# EAGLE schematic back (EAGLE 6.5.0)
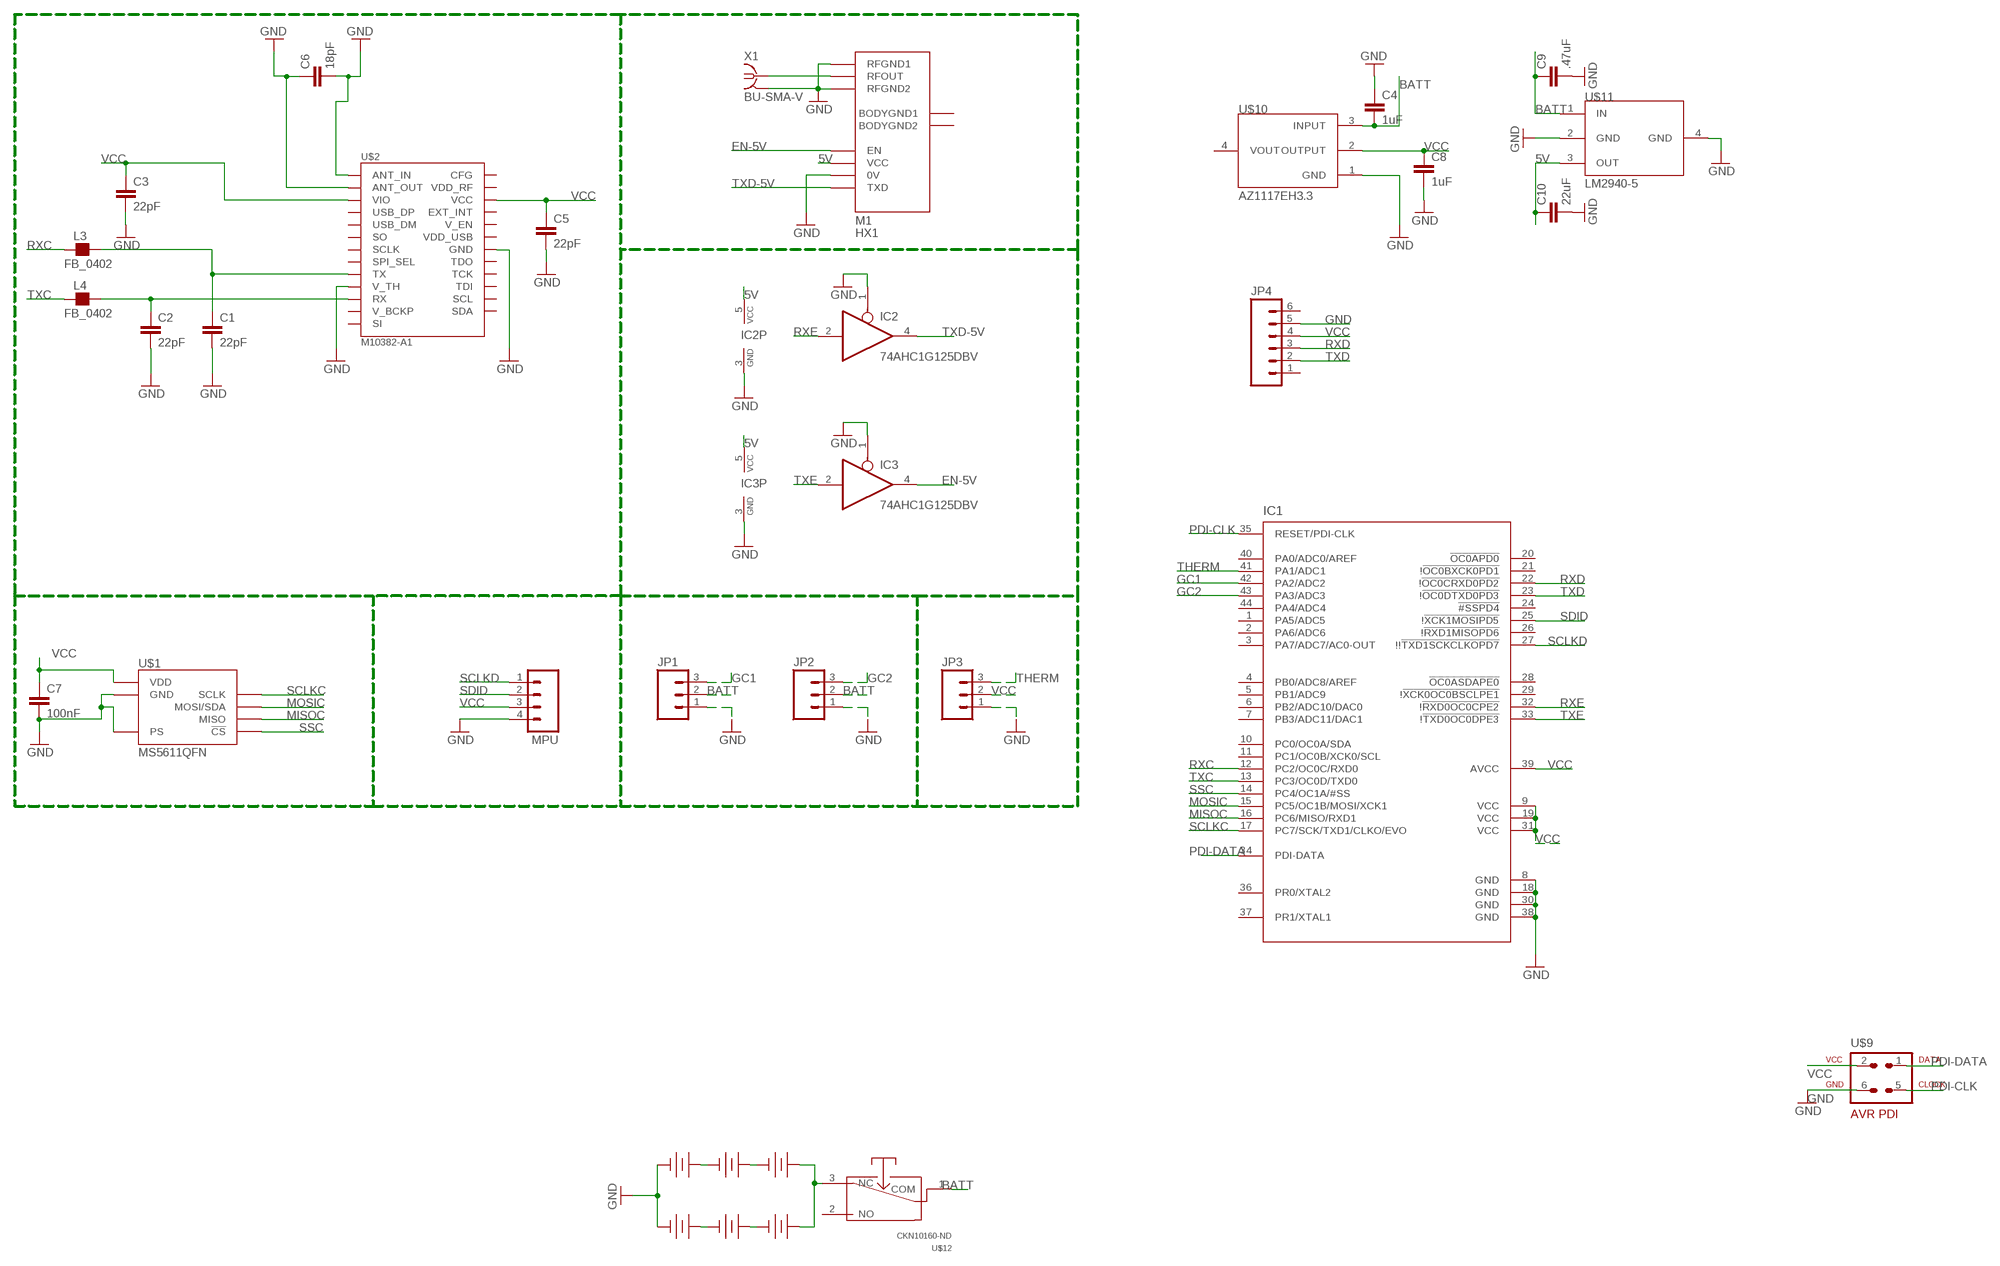
[diagram p0: schematic, sheet 1]

## Parts
C1  22pF  CAP0805  [0805]
C2  22pF  CAP0805  [0805]
C3  22pF  CAP0805  [0805]
C4  1uF  CAP0603-CAP  [0603-CAP]
C5  22pF  CAP0805  [0805]
C6  18pF  CAP0805  [0805]
C7  100nF  CAP0805  [0805]
C8  1uF  CAP0603-CAP  [0603-CAP]
C9  .47uF  CAP0603-CAP  [0603-CAP]
C10  22uF  CAP0603-CAP  [0603-CAP]
IC1  AT-XMEGA-XXA4-AU  [QFP80P1200X1200X120-44N]
IC2  74AHC1G125DBV  [SOT23-5]
IC3  74AHC1G125DBV  [SOT23-5]
JP1  M03JST-PTH  [JST-3-PTH]
JP2  M03JST-PTH  [JST-3-PTH]
JP3  M03JST-PTH  [JST-3-PTH]
JP4  M06POLAR  [MOLEX-1X6]
L3  FB_0402  [L0402]
L4  FB_0402  [L0402]
M1  HX1  [HX1]
MPU  M04  [04P]
U$1  MS5611QFN  [MS5611-01BA01]
U$2  M10382-A1  [M10382-A1]
U$3  123_BATTERY_HOLDERCR-123-A  [CR-123-A_HOLDER]
U$4  123_BATTERY_HOLDERCR-123-A  [CR-123-A_HOLDER]
U$5  123_BATTERY_HOLDERCR-123-A  [CR-123-A_HOLDER]
U$6  123_BATTERY_HOLDERCR-123-A  [CR-123-A_HOLDER]
U$7  123_BATTERY_HOLDERCR-123-A  [CR-123-A_HOLDER]
U$8  123_BATTERY_HOLDERCR-123-A  [CR-123-A_HOLDER]
U$9  AVR-PDIVERT  [AVR-ISP-6]
U$10  AZ1117EH3.3  [SOT-223]
U$11  LM2940-5  [SOT-223]
U$12  CKN10160-ND  [ZMCHFL3R]
X1  BU-SMA-V  [BU-SMA-V]

## Nets
5V: C10.1 IC2.5(VCC) IC3.5(VCC) M1.VCC U$11.3(OUT)
BATT: C4.2 C9.1 JP1.2 JP2.2 U$10.3(INPUT) U$11.1(IN) U$12.1(COM)
EN-5V: IC3.4(O) M1.EN
GC1: IC1.42(PA2/ADC2) JP1.3
GC2: IC1.43(PA3/ADC3) JP2.3
GND: C1.2 C2.2 C3.2 C4.1 C5.2 C6.1 C6.2 C7.2 C8.2 C9.2 C10.2 IC1.8(GND) IC1.18(GND) IC1.30(GND) IC1.38(GND) IC2.1(OE) IC2.3(GND) IC3.1(OE) IC3.3(GND) JP1.1 JP2.1 JP3.1 JP4.5 M1.0V M1.RFGND1 M1.RFGND2 MPU.4 U$1.2(PS) U$1.3(GND) U$2.1(ANT_IN) U$2.2(GND) U$2.3(ANT_OUT) U$2.4(GND) U$2.12(V_TH) U$2.14(GND) U$2.17(GND) U$2.21(GND) U$2.24(GND) U$2.26(GND) U$2.28(GND) U$2.33(GND) U$2.34(GND) U$2.35(GND) U$2.36(GND) U$3.- U$6.- U$9.6 U$10.1(GND) U$11.2(GND) U$11.4(GND) X1.2(GND)
MISOC: IC1.16(PC6/MISO/RXD1) U$1.6(MISO)
MOSIC: IC1.15(PC5/OC1B/MOSI/XCK1) U$1.7(MOSI/SDA)
N$1: C1.1 L3.2 U$2.11(TX)
N$2: C2.1 L4.2 U$2.13(RX)
N$4: U$3.+ U$4.-
N$5: M1.RFOUT X1.1
N$6: U$4.+ U$5.-
N$7: U$5.+ U$8.+ U$12.3(NC)
N$8: U$6.+ U$7.-
N$9: U$7.+ U$8.-
PDI-CLK: IC1.35(RESET/PDI-CLK) U$9.5
PDI-DATA: IC1.34(PDI-DATA) U$9.1
RXC: IC1.12(PC2/OC0C/RXD0) L3.1
RXD: IC1.22(!!OC0CRXD0PD2) JP4.3
RXE: IC1.32(!!RXD0OC0CPE2) IC2.2(I)
SCLKC: IC1.17(PC7/SCK/TXD1/CLKO/EVO) U$1.8(SCLK)
SCLKD: IC1.27(!!!TXD1SCKCLKOPD7) MPU.1
SDID: IC1.25(!!XCK1MOSIPD5) MPU.2
SSC: IC1.14(PC4/OC1A/#SS) U$1.4(!CS!) U$1.5(!CS!)
THERM: IC1.41(PA1/ADC1) JP3.3
TXC: IC1.13(PC3/OC0D/TXD0) L4.1
TXD: IC1.23(!!OC0DTXD0PD3) JP4.2
TXD-5V: IC2.4(O) M1.TXD
TXE: IC1.33(!!TXD0OC0DPE3) IC3.2(I)
VCC: C3.1 C5.1 C7.1 C8.1 IC1.9(VCC) IC1.19(VCC) IC1.31(VCC) IC1.39(AVCC) JP3.2 JP4.4 MPU.3 U$1.1(VDD) U$2.5(VIO) U$2.27(VCC) U$9.2 U$10.2(OUTPUT)
Unconnected: IC1.1(PA5/ADC5) IC1.2(PA6/ADC6) IC1.3(PA7/ADC7/AC0-OUT) IC1.4(PB0/ADC8/AREF) IC1.5(PB1/ADC9) IC1.6(PB2/ADC10/DAC0) IC1.7(PB3/ADC11/DAC1) IC1.10(PC0/OC0A/SDA) IC1.11(PC1/OC0B/XCK0/SCL) IC1.20(!OC0APD0) IC1.21(!!OC0BXCK0PD1) IC1.24(!#SSPD4) IC1.26(!!RXD1MISOPD6) IC1.28(!OC0ASDAPE0) IC1.29(!!XCK0OC0BSCLPE1) IC1.36(PR0/XTAL2) IC1.37(PR1/XTAL1) IC1.40(PA0/ADC0/AREF) IC1.44(PA4/ADC4) JP4.1 JP4.6 M1.BODYGND1 M1.BODYGND2 U$2.6(USB_DP) U$2.7(USB_DM) U$2.8(SO) U$2.9(SCLK) U$2.10(SPI_SEL) U$2.15(V_BCKP) U$2.16(SI) U$2.18(SDA) U$2.19(SCL) U$2.20(TDI) U$2.22(TCK) U$2.23(TDO) U$2.25(VDD_RF) U$2.29(EXT_INT) U$2.30(V_EN) U$2.31(CFG) U$2.32(VDD_USB) U$10.4(VOUT) U$12.2(NO)

## Power pins joined to a net without a drawn wire
GND: X1.3(GND) X1.4(GND) X1.5(GND)

## Library data of the parts
C1-C10 = SparkFun:CAP: Capacitor Standard 0603 ceramic capacitor, and 0.1" leaded capacitor.
IC1 = xmega-a4:AT-XMEGA-XXA4-AU: ATxMega a4 Serie
IC2 IC3 = 74xx-little-us:74*1G125: Single Bus Buffer Gate with 3-State Output
JP1-JP3 = SparkFun-Connectors:M03: Header 3 Standard 3-pin 0.1" header. Use with straight break away headers (SKU : PRT-00116), right angle break away headers (PRT-00553), swiss pins (PRT-00743), machine pins (PRT-00117), and female headers (PRT-00115). Molex polarized connector foot print use with SKU : PRT-08232 with associated crimp pins and housings.
JP4 = SparkFun:M06: Header 6 Standard 6-pin 0.1" header. Use with straight break away headers (SKU : PRT-00116), right angle break away headers (PRT-00553), swiss pins (PRT-00743), machine pins (PRT-00117), and female headers (PRT-00115). Molex polarized connector foot print use with SKU : PRT-08094 with associated crimp pins and housings. NOTES ON THE VARIANTS LOCK and LOCK_LONGPADS... This footprint was designed to help hold the alignment of a through-hole component (i.e. 6-pin header) while soldering it into place. You may notice that each hole has been shifted either up or down by 0.005 of an inch from it's more standard position (which is a perfectly straight line). This slight alteration caused the pins (the squares in the middle) to touch the edges of the holes. Because they are alternating, it causes a "brace" to hold the component in place. 0.005 has proven to be the perfect amount of "off-center" position when using our standard breakaway headers. Although looks a little odd when you look at the bare footprint, once you have a header in there, the alteration is very hard to notice. Also, if you push a header all the way into place, it is covered up entirely on the bottom side. This idea of altering the position of holes to aid alignment will be further integrated into the Sparkfun Library for other footprints. It can help hold any component with 3 or more connection pins.
L3 L4 = rc-master-smd:FB_: FERRITE BEAD
M1 = trackuino:HX1
MPU = con-amp-quick:M04: AMP QUICK CONNECTOR; OC_FARNELL: unknown; OC_NEWARK: unknown
U$1 = SHC:MS5611
U$2 = SHC:M10382-A1: Antenova’s GPS RADIONOVA® M10382 is a single package solution that combines a full GPS engine and antenna on a small SMD module. The M10382 is a highly integrated GPS RF Antenna Module suitable for L1-band GPS and A-GPS systems. The device combines the high performance u-blox 6 GPS position engine with Antenova’s high efficiency antenna technology in a small SMD module. M10382 also benefits from novel external matching that ensures easy tuning for each platform. All front-end and receiver components are contained in a single package laminate base module, providing a complete GPS receiver for optimum performance. The M10382 operates on 1.8V or 3.3V positive supply with low power consumption and several low power modes for further power savings. An accurate 0.5ppm TCXO and very low noise LNA ensures high sensitivity and short TTFF. The M10382 is supported by u-blox stand alone software and is compatible with UART, SPI, DDC, I2C and USB host processor interfaces.
U$3-U$8 = SHC:123_BATTERY_HOLDER
U$9 = avr-7:AVR-PDI: AVR PDI programming interface connector
U$10 = Physoon:AZ1117EH
U$11 = Physoon:LM2940
U$12 = SHC:CKN10160-ND: CONTACT RATING: F7: 3A @ 125 VAC ELECTRICAL LIFE: 15,000 Cycles. @ 3A INSULATION RESISTANCE: 100 M ohm min. DIELECTRIC STRENGTH: 1000 Vrms. OPERATING TEMPERATURE: ?30ºC to 85ºC. OPERATING FORCE: CJ: 150 grams, CH: 90 grams.
X1 = con-coax:BU-SMA-V: FEMALE SMA CONNECTOR Radiall distributor RS 112-3794; OC_FARNELL: unknown; OC_NEWARK: unknown